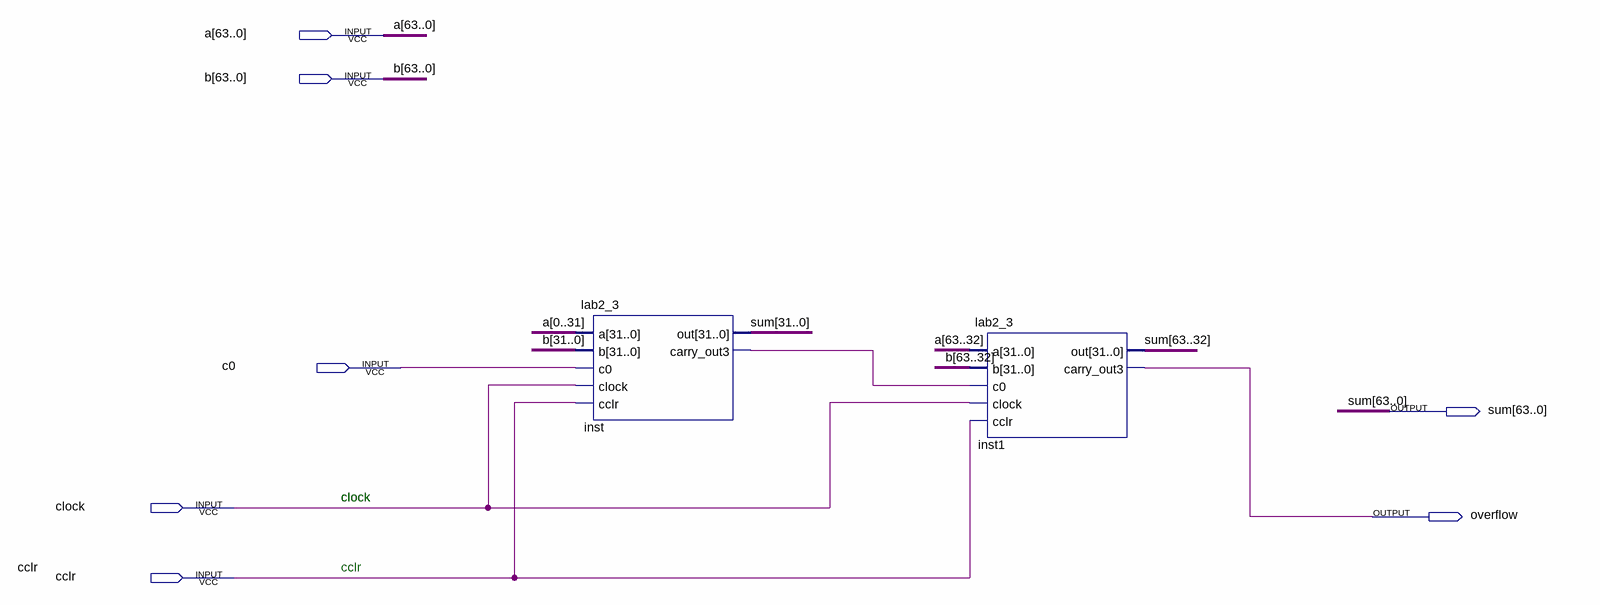
[diagram p0: schematic sheet]
// Quartus schematic lab2_4.bdf as structural Verilog: 2 symbols, 7 pins
module lab2_4 (
  input  [63:0] a,
  input  [63:0] b,
  input  c0,
  input  clock,
  input  cclr,
  output [63:0] sum,
  output overflow
);

  wire inst_carry_out3;

  lab2_3 inst (
    .a({a[0], a[1], a[2], a[3], a[4], a[5], a[6], a[7], a[8], a[9], a[10], a[11], a[12], a[13], a[14], a[15], a[16], a[17], a[18], a[19], a[20], a[21], a[22], a[23], a[24], a[25], a[26], a[27], a[28], a[29], a[30], a[31]}),
    .b(b[31:0]), .c0(c0), .clock(clock), .cclr(cclr), .out(sum[31:0]), .carry_out3(inst_carry_out3));
  lab2_3 inst1 (
    .a(a[63:32]), .b(b[63:32]), .c0(inst_carry_out3), .clock(clock), .cclr(cclr), .out(sum[63:32]),
    .carry_out3(overflow));

  // Notes on the sheet:
  //   clock
  //   cclr
endmodule
